# EAGLE design Blinker_07 (EAGLE 6.6.0)
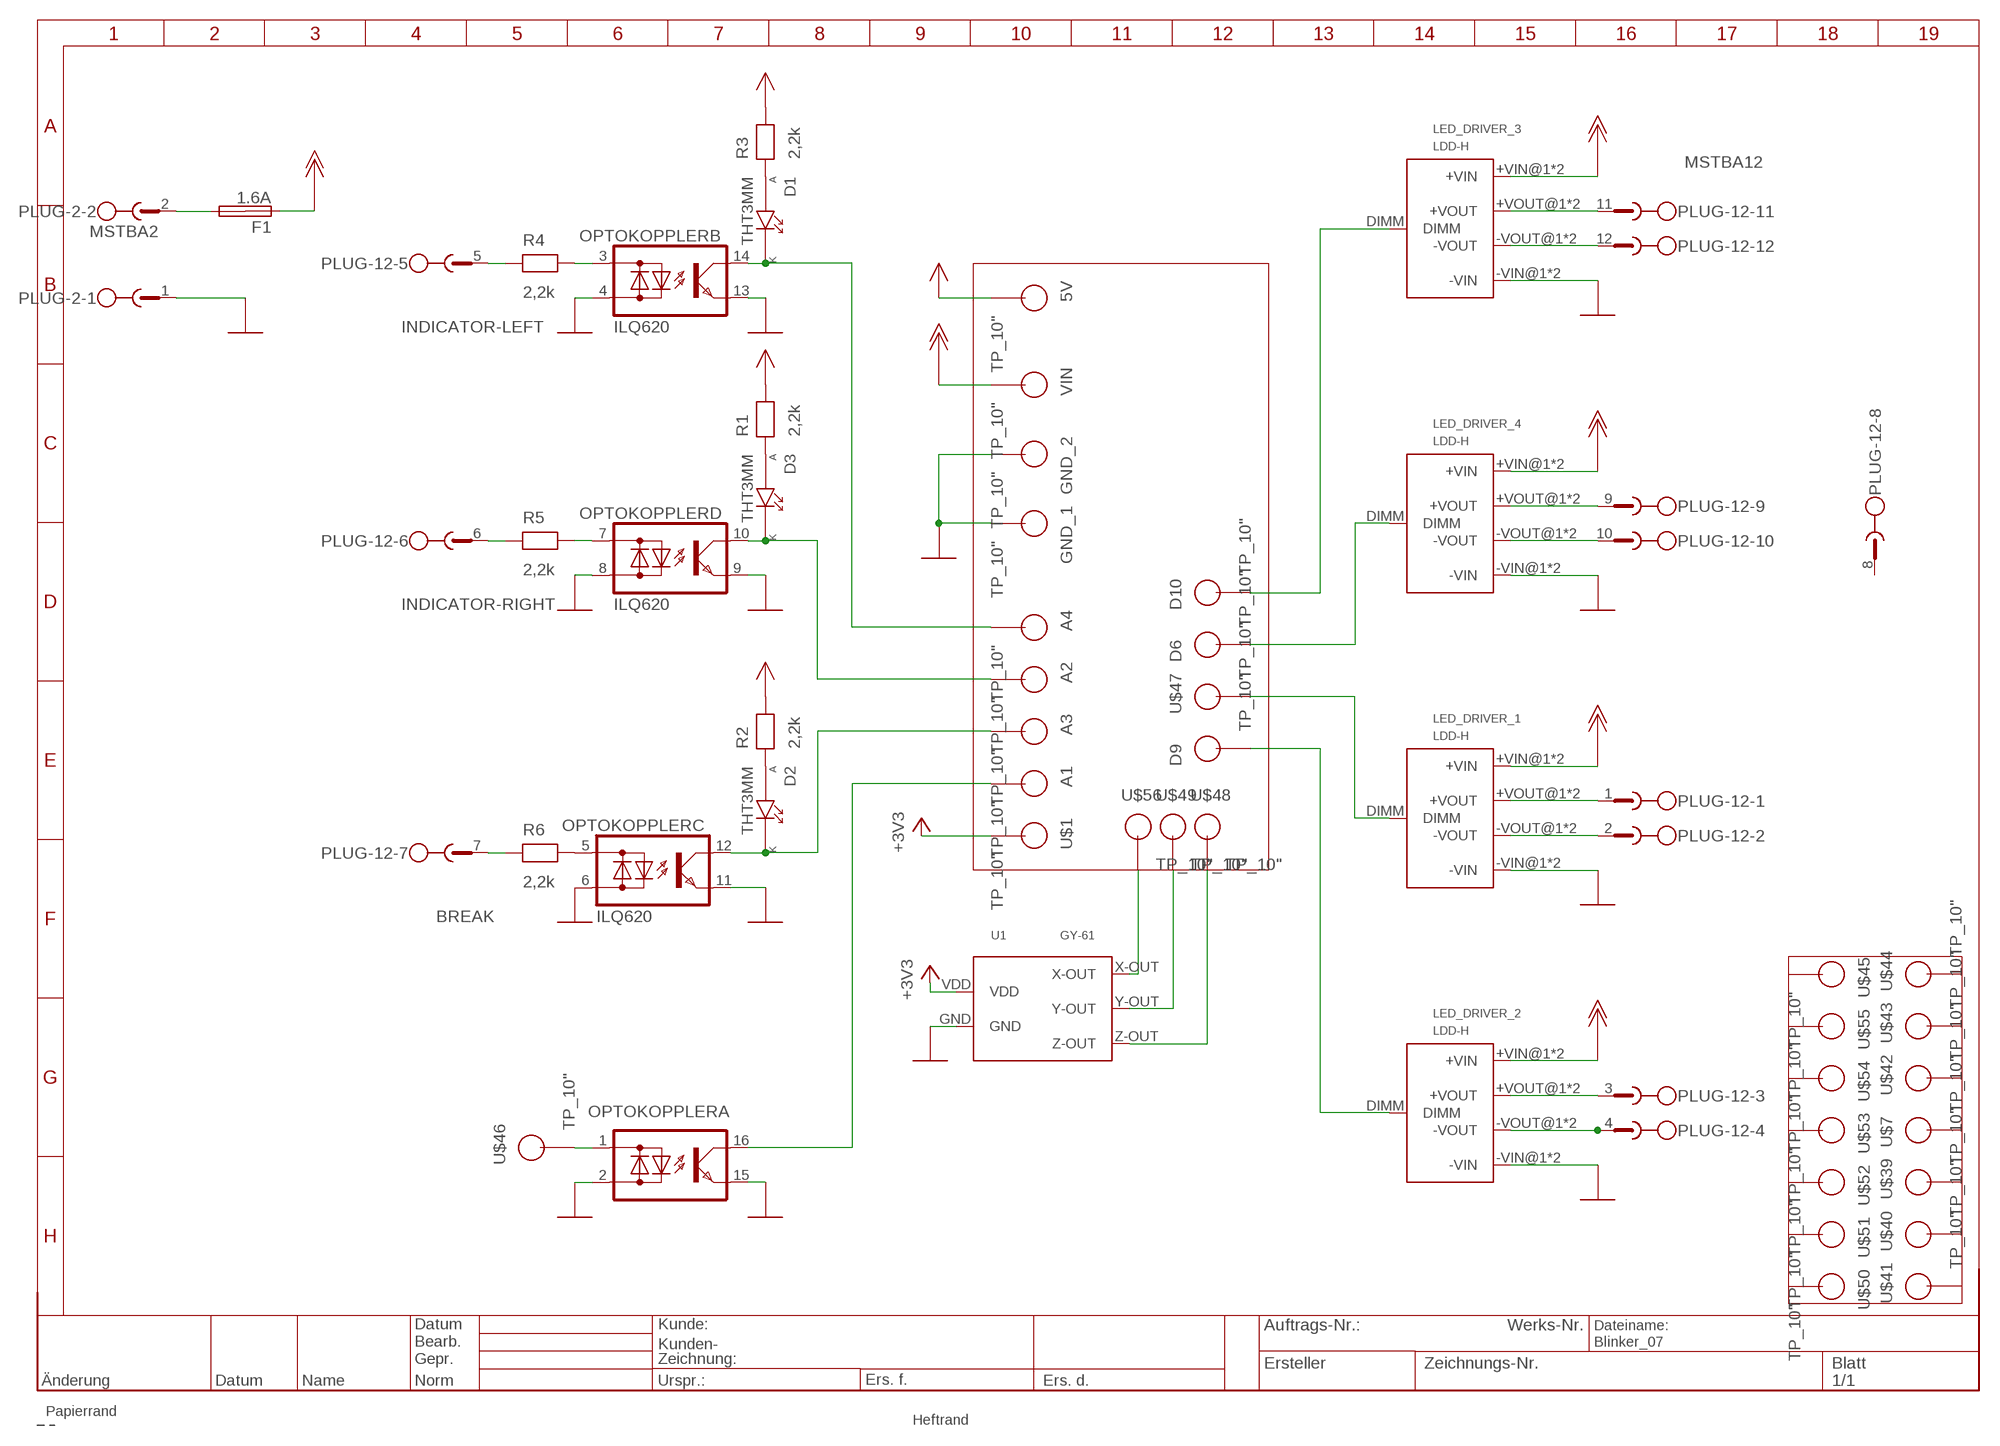
[diagram p0: schematic, sheet 1]

## Parts
5V  TP_10"  [TP_10]
A1  TP_10"  [TP_10]
A2  TP_10"  [TP_10]
A3  TP_10"  [TP_10]
A4  TP_10"  [TP_10]
D1  THT3MM  [THT3MM]
D2  THT3MM  [THT3MM]
D3  THT3MM  [THT3MM]
D6  TP_10"  [TP_10]
D9  TP_10"  [TP_10]
D10  TP_10"  [TP_10]
F1  1.6A  SHK20Q  [SHK20Q]
GND_1  TP_10"  [TP_10]
GND_2  TP_10"  [TP_10]
LED_DRIVER_1  LDD-H  [LDD-H]
LED_DRIVER_2  LDD-H  [LDD-H]
LED_DRIVER_3  LDD-H  [LDD-H]
LED_DRIVER_4  LDD-H  [LDD-H]
OPTOKOPPLER  ILQ620  [DIL16]
PLUG-2  MSTBA2  [MSTBA2]
PLUG-12  MSTBA12  [MSTBA12]
R1  2,2k  RESEU-10  [R-10]
R2  2,2k  RESEU-10  [R-10]
R3  2,2k  RESEU-10  [R-10]
R4  2,2k  RESEU-10  [R-10]
R5  2,2k  RESEU-10  [R-10]
R6  2,2k  RESEU-10  [R-10]
U1  GY-61  [GY-61]
U$1  TP_10"  [TP_10]
U$7  TP_10"  [TP_10]
U$39  TP_10"  [TP_10]
U$40  TP_10"  [TP_10]
U$41  TP_10"  [TP_10]
U$42  TP_10"  [TP_10]
U$43  TP_10"  [TP_10]
U$44  TP_10"  [TP_10]
U$45  TP_10"  [TP_10]
U$46  TP_10"  [TP_10]
U$47  TP_10"  [TP_10]
U$48  TP_10"  [TP_10]
U$49  TP_10"  [TP_10]
U$50  TP_10"  [TP_10]
U$51  TP_10"  [TP_10]
U$52  TP_10"  [TP_10]
U$53  TP_10"  [TP_10]
U$54  TP_10"  [TP_10]
U$55  TP_10"  [TP_10]
U$56  TP_10"  [TP_10]
VIN  TP_10"  [TP_10]

## Nets
+3V3: U1.VDD U$1.P$1(TP_13)
+5V: 5V.P$1(TP_13) R1.2 R2.2 R3.2
+12V: F1.1A LED_DRIVER_1.+VIN@1(+VIN) LED_DRIVER_1.+VIN@2(+VIN) LED_DRIVER_2.+VIN@1(+VIN) LED_DRIVER_2.+VIN@2(+VIN) LED_DRIVER_3.+VIN@1(+VIN) LED_DRIVER_3.+VIN@2(+VIN) LED_DRIVER_4.+VIN@1(+VIN) LED_DRIVER_4.+VIN@2(+VIN) VIN.P$1(TP_13)
BLAULICHT: LED_DRIVER_2.-VOUT@1(-VOUT) LED_DRIVER_2.-VOUT@2(-VOUT) PLUG-12.4
BLUE-LED: D6.P$1(TP_13) LED_DRIVER_4.DIMM
BREAK: PLUG-12.7 R6.1
BREAK-LED: D10.P$1(TP_13) LED_DRIVER_3.DIMM
GND: GND_1.P$1(TP_13) GND_2.P$1(TP_13) LED_DRIVER_1.-VIN@1(-VIN) LED_DRIVER_1.-VIN@2(-VIN) LED_DRIVER_2.-VIN@1(-VIN) LED_DRIVER_2.-VIN@2(-VIN) LED_DRIVER_3.-VIN@1(-VIN) LED_DRIVER_3.-VIN@2(-VIN) LED_DRIVER_4.-VIN@1(-VIN) LED_DRIVER_4.-VIN@2(-VIN) OPTOKOPPLER.2(A:AC2) OPTOKOPPLER.4(B:AC2) OPTOKOPPLER.6(C:AC2) OPTOKOPPLER.8(D:AC2) OPTOKOPPLER.9(D:E) OPTOKOPPLER.11(C:E) OPTOKOPPLER.13(B:E) OPTOKOPPLER.15(A:E) PLUG-2.1 U1.GND
INDICATOR-LEFT: PLUG-12.5 R4.1
INDICATOR-RIGHT: PLUG-12.6 R5.1
LED_2: D1.A(P1A) R3.1
LEFT-LED: LED_DRIVER_1.DIMM U$47.P$1(TP_13)
N$1: F1.2A PLUG-2.2
N$2: D3.A(P1A) R1.1
N$4: A3.P$1(TP_13) D2.K(P2K) OPTOKOPPLER.12(C:C)
N$5: OPTOKOPPLER.1(A:AC1) U$46.P$1(TP_13)
N$10: A1.P$1(TP_13) OPTOKOPPLER.16(A:C)
N$11: OPTOKOPPLER.7(D:AC1) R5.2
N$12: U1.X-OUT U$56.P$1(TP_13)
N$13: U1.Y-OUT U$49.P$1(TP_13)
N$14: LED_DRIVER_1.+VOUT@1(+VOUT) LED_DRIVER_1.+VOUT@2(+VOUT) PLUG-12.1
N$15: LED_DRIVER_1.-VOUT@1(-VOUT) LED_DRIVER_1.-VOUT@2(-VOUT) PLUG-12.2
N$16: LED_DRIVER_2.+VOUT@1(+VOUT) LED_DRIVER_2.+VOUT@2(+VOUT) PLUG-12.3
N$17: LED_DRIVER_3.-VOUT@1(-VOUT) LED_DRIVER_3.-VOUT@2(-VOUT) PLUG-12.12
N$18: LED_DRIVER_3.+VOUT@1(+VOUT) LED_DRIVER_3.+VOUT@2(+VOUT) PLUG-12.11
N$19: LED_DRIVER_4.-VOUT@1(-VOUT) LED_DRIVER_4.-VOUT@2(-VOUT) PLUG-12.10
N$20: D2.A(P1A) R2.1
N$21: LED_DRIVER_4.+VOUT@1(+VOUT) LED_DRIVER_4.+VOUT@2(+VOUT) PLUG-12.9
N$22: OPTOKOPPLER.5(C:AC1) R6.2
N$23: U1.Z-OUT U$48.P$1(TP_13)
N$24: OPTOKOPPLER.3(B:AC1) R4.2
RIGHT-LED: D9.P$1(TP_13) LED_DRIVER_2.DIMM
SCH_LI_3: A2.P$1(TP_13) D3.K(P2K) OPTOKOPPLER.10(D:C)
SCH_RE_3: A4.P$1(TP_13) D1.K(P2K) OPTOKOPPLER.14(B:C)
Unconnected: F1.1B F1.2B PLUG-12.8 U$7.P$1(TP_13) U$39.P$1(TP_13) U$40.P$1(TP_13) U$41.P$1(TP_13) U$42.P$1(TP_13) U$43.P$1(TP_13) U$44.P$1(TP_13) U$45.P$1(TP_13) U$50.P$1(TP_13) U$51.P$1(TP_13) U$52.P$1(TP_13) U$53.P$1(TP_13) U$54.P$1(TP_13) U$55.P$1(TP_13)

## Library data of the parts
5V A1-A4 D6 D9 D10 GND_1 GND_2 U$1 U$7 U$39-U$56 VIN = SUPPLY:TP_10
D1-D3 = LED:THT3MM
F1 = fuse:SHK20Q: FUSE HOLDER 5 x 20 mm, SH contact, E1207 Buerklin 64G6061; OC_FARNELL: unknown; OC_NEWARK: unknown
LED_DRIVER_1-LED_DRIVER_4 = SPEZIAL:LDD-H
OPTOKOPPLER = optocoupler:ILQ620: SIEMENS OPTO COUPLER
PLUG-2 = con-phoenix-508:MSTBA2: PHOENIX; MF: FARNELL; MPN: 1757242; OC_FARNELL: 3705171; OC_NEWARK: 71C4161
PLUG-12 = con-phoenix-508:MSTBA12: PHOENIX; MPN: 1757349; OC_FARNELL: 3705250; OC_NEWARK: 71C4169
R1-R6 = R-C:RESEU-10
U1 = Indicator:GY-61

## Board
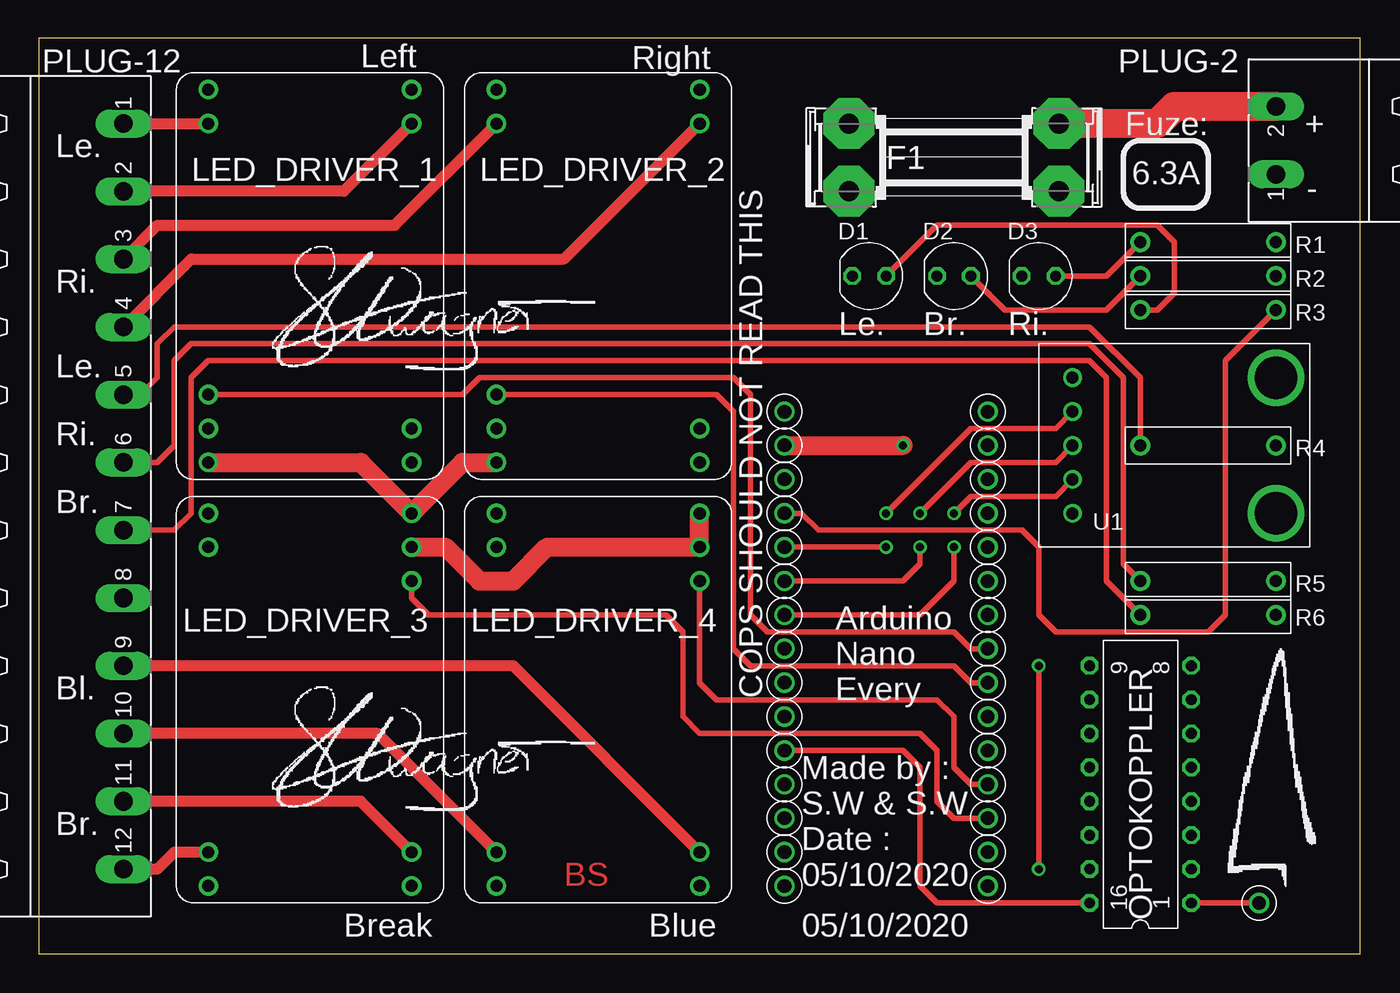
[diagram p1: board, top side]
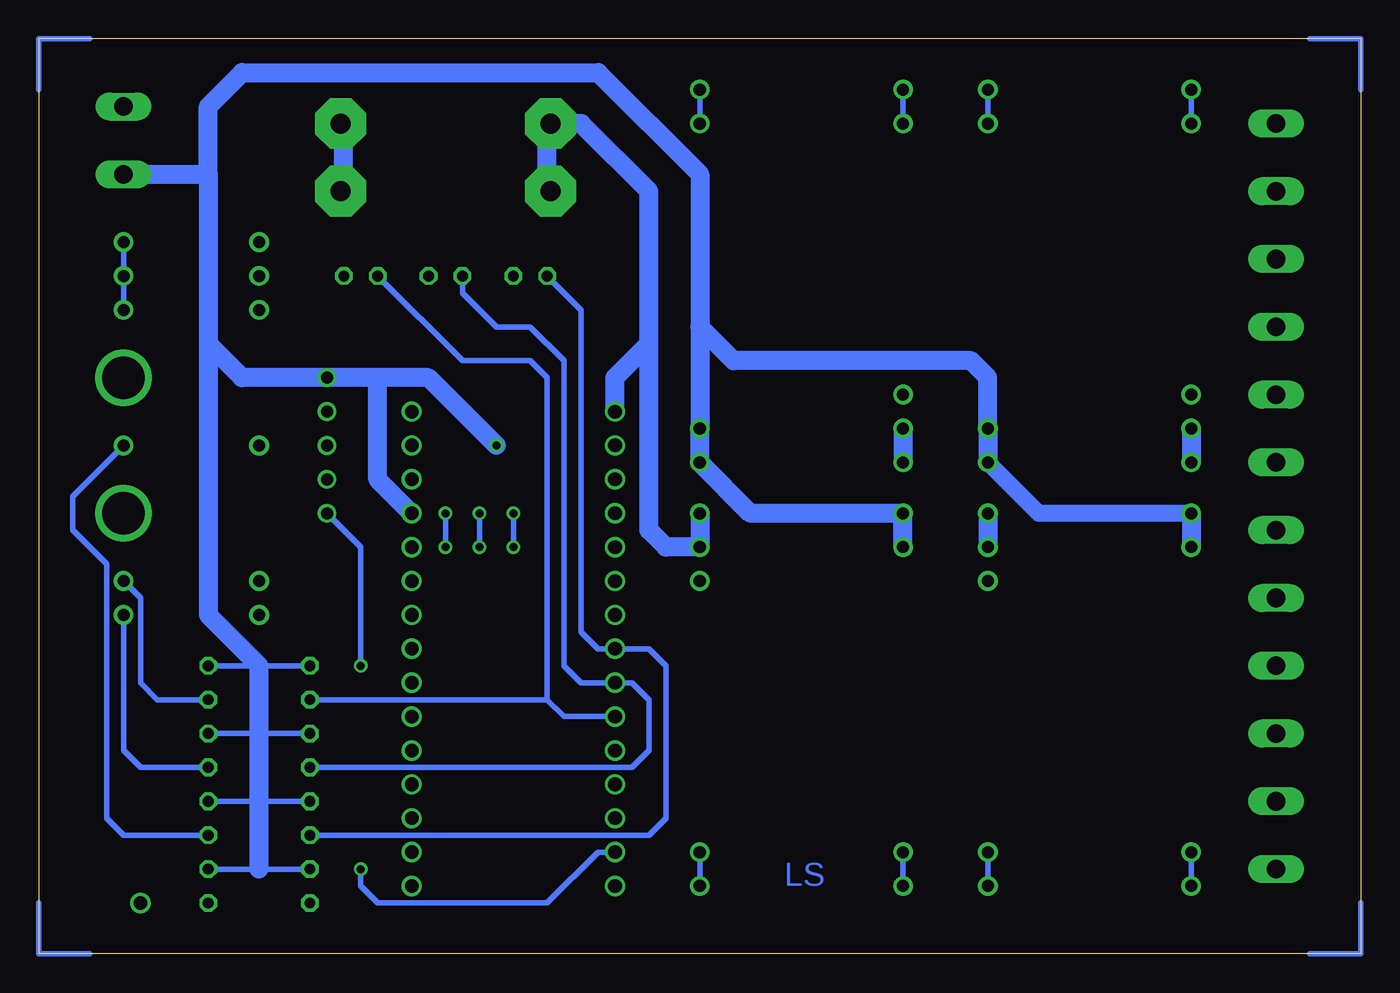
[diagram p2: board, bottom side, seen from below]

Size 99.04 x 68.63 mm. Coordinates in mm from the lower left corner, seen from the top.
Outline: 0,0 99.04,0 99.04,68.63 0,68.63 0,0
Copper layers (1*16): Top 0.035mm / dielectric 1.5mm / Bottom 0.035mm
Design rules "default": minimum track width 10mil, minimum drill 24mil, track to track 8mil, track to pad 8mil, pad to pad 8mil, via to via 8mil, smd to smd 8mil, copper to edge 40mil, drill to drill 8mil, minimum pad ring 10mil, minimum via ring 8mil, stop-mask expansion 4mil, vias tented up to drill 0mil, thermal gap 10mil

### Footprints (pad centres in the part's own frame; a part is rotated, then mirrored left to right if it is on the bottom)
TP_10 = drill 1.016: P$1 0,0
THT3MM = drill 0.813 octagon: A -1.27,0; K 1.27,0
SHK20Q = drill 1.5 pad 3.81 octagon: 1A -7.874,2.54; 1B -7.874,-2.54; 2A 7.874,2.54; 2B 7.874,-2.54
LDD-H = drill 0.9 pad 1.473: +VIN@1 -12.7,7.62; +VIN@2 -10.16,7.62; +VOUT@1 12.7,7.62; +VOUT@2 15.24,7.62; -VIN@1 -12.7,-7.62; -VIN@2 -10.16,-7.62; -VOUT@1 12.7,-7.62; -VOUT@2 15.24,-7.62; DIMM -7.62,7.62
DIL16 = drill 0.813 octagon: 1 -8.89,-3.81; 2 -6.35,-3.81; 3 -3.81,-3.81; 4 -1.27,-3.81; 5 1.27,-3.81; 6 3.81,-3.81; 7 6.35,-3.81; 8 8.89,-3.81; 9 8.89,3.81; 10 6.35,3.81; 11 3.81,3.81; 12 1.27,3.81; 13 -1.27,3.81; 14 -3.81,3.81; 15 -6.35,3.81; 16 -8.89,3.81
MSTBA2 = drill 1.397 long: 1 -2.54,5.08; 2 2.54,5.08
MSTBA12 = drill 1.397 long: 1 -27.94,5.08; 2 -22.86,5.08; 3 -17.78,5.08; 4 -12.7,5.08; 5 -7.62,5.08; 6 -2.54,5.08; 7 2.54,5.08; 8 7.62,5.08; 9 12.7,5.08; 10 17.78,5.08; 11 22.86,5.08; 12 27.94,5.08
R-10 = drill 0.9 pad 1.473: 1 -5.08,0; 2 5.08,0
GY-61 = drill 0.9: GND 0,-5.08; VDD 0,5.08; X-OUT 0,2.54; Y-OUT 0,0; Z-OUT 0,-2.54 | drill 3.2: P$6 -15.24,5.08; P$7 -15.24,-5.08

### Placement (x,y rotation side)
5V  55.88,33.02 270 top
A1  55.88,15.24 270 top
A2  55.88,17.78 270 top
A3  55.88,20.32 270 top
A4  55.88,22.86 270 top
D1  62.23,50.8 180 top
D2  68.58,50.8 180 top
D3  74.93,50.8 180 top
D6  71.12,12.7 270 top
D9  71.12,20.32 270 top
D10  71.12,10.16 270 top
F1  68.58,59.69 0 top
GND_1  55.88,38.1 270 top
GND_2  71.12,33.02 270 top
LED_DRIVER_1  20.32,49.53 90 top
LED_DRIVER_2  41.91,49.53 90 top
LED_DRIVER_3  20.32,20.32 270 top
LED_DRIVER_4  41.91,20.32 270 top
OPTOKOPPLER  82.55,12.7 90 top
PLUG-2  97.79,60.96 90 top
PLUG-12  1.27,34.29 270 top
R1  87.63,53.34 0 top
R2  87.63,50.8 0 top
R3  87.63,48.26 0 top
R4  87.63,38.1 0 top
R5  87.63,27.94 0 top
R6  87.63,25.4 0 top
U1  77.47,38.1 180 top
U$1  55.88,7.62 0 top
U$7  71.12,5.08 270 top
U$39  71.12,38.1 270 top
U$40  71.12,40.64 270 top
U$41  71.12,7.62 270 top
U$42  55.88,35.56 270 top
U$43  71.12,27.94 270 top
U$44  71.12,17.78 270 top
U$45  71.12,35.56 270 top
U$46  91.44,3.81 270 top
U$47  71.12,22.86 270 top
U$48  55.88,30.48 270 top
U$49  55.88,27.94 270 top
U$50  55.88,12.7 270 top
U$51  71.12,25.4 270 top
U$52  71.12,30.48 270 top
U$53  71.12,15.24 270 top
U$54  55.88,5.08 270 top
U$55  55.88,10.16 270 top
U$56  55.88,25.4 270 top
VIN  55.88,40.64 270 top

### Tracks (layer width: path | path; a pad name or v marks a point on that pad's centre or on a via)
+3V3  (via drill 0.6)
  Top 0.406: v74.93,6.35 v74.93,21.59
  Bottom 0.406: U$1.P$1 57.15,7.62 60.96,3.81 73.66,3.81 74.93,5.08 v74.93,6.35 | v74.93,21.59 74.93,30.48 U1.VDD
+5V
  Top 0.406: 5V.P$1 57.15,33.02 58.42,31.75 73.66,31.75 74.93,30.48 74.93,25.4 76.2,24.13 87.63,24.13 88.9,25.4 88.9,44.45 R3.2
  Bottom 0.406: R1.2 R2.2 R3.2
+12V
  Top 1.422: LED_DRIVER_1.+VIN@1 24.13,36.83 LED_DRIVER_3.+VIN@1 31.75,36.83 LED_DRIVER_2.+VIN@1 | LED_DRIVER_3.+VIN@2 30.48,30.48 33.02,27.94 35.56,27.94 38.1,30.48 LED_DRIVER_4.+VIN@2 LED_DRIVER_4.+VIN@1
  Bottom 1.27: F1.1A 58.42,62.23
  Bottom 1.422: LED_DRIVER_3.+VIN@1 LED_DRIVER_3.+VIN@2 | LED_DRIVER_1.+VIN@2 LED_DRIVER_1.+VIN@1 | LED_DRIVER_2.+VIN@2 LED_DRIVER_2.+VIN@1 | LED_DRIVER_4.+VIN@1 LED_DRIVER_4.+VIN@2 52.07,30.48 53.34,31.75 53.34,45.72 | 53.34,45.72 53.34,57.15 58.42,62.23 60.96,62.23 60.96,57.15 | VIN.P$1 55.88,43.18 53.34,45.72
BLAULICHT
  Top 0.813: PLUG-12.4 11.43,52.07 39.37,52.07 LED_DRIVER_2.-VOUT@1
  Bottom 0.406: LED_DRIVER_2.-VOUT@2 LED_DRIVER_2.-VOUT@1
BLUE-LED
  Top 0.406: LED_DRIVER_4.DIMM 49.53,20.32 50.8,19.05 67.31,19.05 68.58,17.78 68.58,13.97 69.85,12.7 D6.P$1
BREAK
  Top 0.406: PLUG-12.7 10.16,31.75 11.43,33.02 11.43,43.18 12.7,44.45 78.74,44.45 80.01,43.18 80.01,27.94 R6.1
BREAK-LED
  Top 0.406: LED_DRIVER_3.DIMM 27.94,26.67 29.21,25.4 46.99,25.4 48.26,24.13 48.26,17.78 49.53,16.51 66.04,16.51 67.31,15.24 67.31,11.43 68.58,10.16 D10.P$1
GND  (via drill 0.6)
  Top 1.422: GND_1.P$1 v64.77,38.1
  Bottom 0.406: OPTOKOPPLER.8 82.55,21.59 OPTOKOPPLER.9 | OPTOKOPPLER.2 82.55,6.35 OPTOKOPPLER.15 | OPTOKOPPLER.13 82.55,11.43 OPTOKOPPLER.4 | OPTOKOPPLER.11 82.55,16.51 OPTOKOPPLER.6
  Bottom 1.27: LED_DRIVER_3.-VIN@1 24.13,33.02 LED_DRIVER_1.-VIN@1 | 82.55,21.59 82.55,16.51 82.55,11.43 82.55,6.35
  Bottom 1.422: 86.36,58.42 86.36,63.5 83.82,66.04 57.15,66.04 49.53,58.42 49.53,46.99 | 49.53,46.99 LED_DRIVER_2.-VIN@2 LED_DRIVER_2.-VIN@1 45.72,33.02 LED_DRIVER_4.-VIN@1 LED_DRIVER_4.-VIN@2 | LED_DRIVER_3.-VIN@1 LED_DRIVER_3.-VIN@2 | LED_DRIVER_1.-VIN@1 LED_DRIVER_1.-VIN@2 27.94,43.18 29.21,44.45 46.99,44.45 49.53,46.99 | PLUG-2.1 86.36,58.42 | 82.55,6.35 82.55,21.59 86.36,25.4 86.36,45.72 | 86.36,58.42 86.36,45.72 | 86.36,45.72 83.82,43.18 U1.GND 73.66,43.18 | v64.77,38.1 69.85,43.18 73.66,43.18 | GND_2.P$1 73.66,35.56 73.66,43.18
INDICATOR-LEFT
  Top 0.406: R4.1 82.55,43.18 78.74,46.99 10.16,46.99 8.89,45.72 8.89,43.18 7.62,41.91 PLUG-12.5
INDICATOR-RIGHT
  Top 0.406: PLUG-12.6 8.89,36.83 10.16,38.1 10.16,44.45 11.43,45.72 78.74,45.72 81.28,43.18 81.28,29.21 R5.1
LED_2
  Top 0.406: R3.1 83.82,48.26 85.09,49.53 85.09,53.34 83.82,54.61 67.31,54.61 D1.A
LEFT-LED
  Top 0.406: LED_DRIVER_1.DIMM 31.75,41.91 33.02,43.18 52.07,43.18 53.34,41.91 53.34,25.4 54.61,24.13 68.58,24.13 69.85,22.86 U$47.P$1
N$1
  Top 1.27: 83.82,62.23 F1.2A
  Top 2.184: PLUG-2.2 85.09,63.5 83.82,62.23 76.2,62.23
N$2
  Top 0.406: D3.A 80.01,50.8 R1.1
N$3
  Bottom 0.406: 99.06,3.81 99.06,0 95.25,0
N$4
  Bottom 0.406: D2.K 67.31,49.53 64.77,46.99 62.23,46.99 59.69,44.45 59.69,21.59 58.42,20.32 A3.P$1 54.61,20.32 53.34,19.05 53.34,15.24 54.61,13.97 OPTOKOPPLER.12
N$5
  Top 0.406: OPTOKOPPLER.1 U$46.P$1
N$6
  Bottom 0.406: 95.25,68.58 99.06,68.58 99.06,64.77
N$7
  Bottom 0.406: 3.81,68.58 0,68.58 0,64.77
N$8
  Bottom 0.406: 3.81,0 0,0 0,2.54 0,3.81
N$9
  Bottom 1.422: 76.2,57.15 76.2,62.23
N$10
  Top 0.406: A1.P$1 64.77,15.24 66.04,13.97 66.04,5.08 67.31,3.81 OPTOKOPPLER.16
N$11
  Bottom 0.406: OPTOKOPPLER.7 90.17,19.05 91.44,20.32 91.44,26.67 R5.2
N$12  (via drill 0.6)
  Top 0.406: U$56.P$1 66.04,25.4 68.58,27.94 v68.58,30.48 | v68.58,33.02 69.85,34.29 76.2,34.29 U1.X-OUT
  Bottom 0.406: v68.58,30.48 v68.58,33.02
N$13  (via drill 0.6)
  Top 0.406: U$49.P$1 64.77,27.94 66.04,29.21 v66.04,30.48 | v66.04,33.02 69.85,36.83 76.2,36.83 U1.Y-OUT
  Bottom 0.406: v66.04,30.48 v66.04,33.02
N$14
  Top 0.813: PLUG-12.1 LED_DRIVER_1.+VOUT@1
  Bottom 0.406: LED_DRIVER_1.+VOUT@2 LED_DRIVER_1.+VOUT@1
N$15
  Top 0.813: LED_DRIVER_1.-VOUT@1 22.86,57.15 PLUG-12.2
  Bottom 0.406: LED_DRIVER_1.-VOUT@2 LED_DRIVER_1.-VOUT@1
N$16
  Top 0.813: PLUG-12.3 8.89,54.61 26.67,54.61 LED_DRIVER_2.+VOUT@1
  Bottom 0.406: LED_DRIVER_2.+VOUT@2 LED_DRIVER_2.+VOUT@1
N$17
  Top 0.813: LED_DRIVER_3.-VOUT@1 10.16,7.62 8.89,6.35 PLUG-12.12
  Bottom 0.406: LED_DRIVER_3.-VOUT@1 LED_DRIVER_3.-VOUT@2
N$18
  Top 0.813: LED_DRIVER_3.+VOUT@1 24.13,11.43 PLUG-12.11
  Bottom 0.406: LED_DRIVER_3.+VOUT@1 LED_DRIVER_3.+VOUT@2
N$19
  Top 0.813: LED_DRIVER_4.-VOUT@1 25.4,16.51 PLUG-12.10
  Bottom 0.406: LED_DRIVER_4.-VOUT@1 LED_DRIVER_4.-VOUT@2
N$20
  Top 0.406: D2.A 72.39,48.26 80.01,48.26 R2.1
N$21
  Top 0.813: LED_DRIVER_4.+VOUT@1 35.56,21.59 PLUG-12.9
  Bottom 0.406: LED_DRIVER_4.+VOUT@1 LED_DRIVER_4.+VOUT@2
N$22
  Bottom 0.406: R6.2 92.71,15.24 91.44,13.97 OPTOKOPPLER.5
N$23  (via drill 0.6)
  Top 0.406: U1.Z-OUT 76.2,39.37 69.85,39.37 v63.5,33.02 | v63.5,30.48 U$48.P$1
  Bottom 0.406: v63.5,33.02 v63.5,30.48
N$24
  Bottom 0.406: R4.2 96.52,34.29 96.52,31.75 93.98,29.21 93.98,10.16 92.71,8.89 OPTOKOPPLER.3
RIGHT-LED
  Top 0.406: LED_DRIVER_2.DIMM 50.8,41.91 52.07,40.64 52.07,22.86 53.34,21.59 68.58,21.59 69.85,20.32 D9.P$1
SCH_LI_3
  Bottom 0.406: A2.P$1 59.69,17.78 60.96,19.05 | 60.96,19.05 60.96,43.18 62.23,44.45 67.31,44.45 D3.K | OPTOKOPPLER.10 60.96,19.05
SCH_RE_3
  Bottom 0.406: D1.K 58.42,48.26 58.42,24.13 57.15,22.86 A4.P$1 53.34,22.86 52.07,21.59 52.07,10.16 53.34,8.89 OPTOKOPPLER.14

### Text on the board
Top: BS
Bottom: LS
tNames: Left | Right | Fuze: | + | Le. | 6.3A | - | Ri. | Le. | Br. | Ri. | Le. | Ri. | Br. | Bl. | COPS SHOULD NOT READ THIS | Arduino / Nano / Every | Br. | Made by : / S.W & S.W / Date : / 05/10/2020 | Break | Blue | 05/10/2020